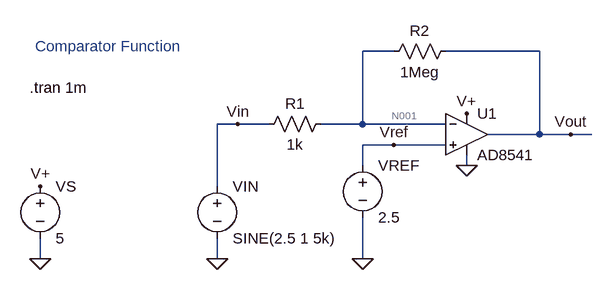
[diagram p0: schematic OpAmp_Comparator.asc]
* OpAmp_Comparator.asc
VREF Vref 0 2.5
VS V+ 0 5
* U1: AD8541 (symbol AD8541 not available, pins judged from their places): In+=Vref In-=N001 V+=V+ V-=0 OUT=Vout
R2 Vout N001 1Meg
VIN Vin 0 SINE(2.5 1 5k)
R1 N001 Vin 1k
.tran 1m
* Comparator Function
.backanno
.end

* Results of the author's LTspice run, read from the files saved beside the schematic
* Operating Point, zero values left out:
*   V(n001) = 2.499 V
*   V(v+) = 5 V
*   V(vin) = 2.5 V
*   V(vout) = 1.508 V
*   V(vref) = 2.5 V
*   I(R1) = -990.7 nA
*   I(R2) = -990.7 nA
*   I(VIN) = -990.7 nA
*   I(VREF) = 3.95 pA
*   I(VS) = -45.26 µA
*   Ix(u1:1) = -3.95 pA
*   Ix(u1:2) = -4.05 pA
*   Ix(u1:45) = 990.7 nA
*   Ix(u1:50) = -46.25 µA
*   Ix(u1:99) = 45.26 µA
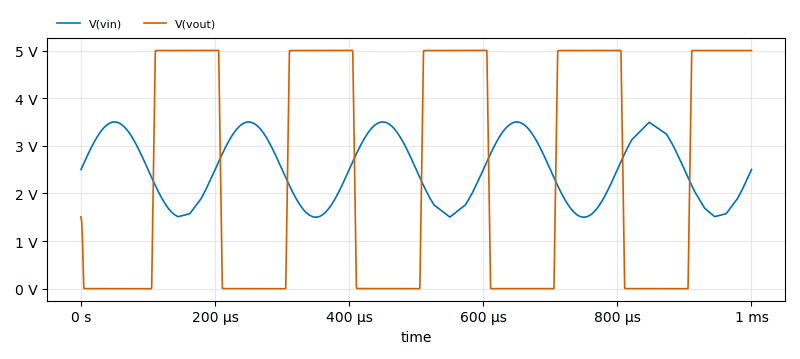
[diagram p1: Transient Analysis of OpAmp_Comparator.asc, plotted from the saved traces]
* Transient Analysis, 1 run:
*   V(vin): min 1.5 V, max 3.5 V, average 2.501 V, rms 2.598 V, last 2.5 V
*   V(vout): min -3.473 mV, max 5.004 V, average 2.462 V, rms 3.479 V, last 5 V